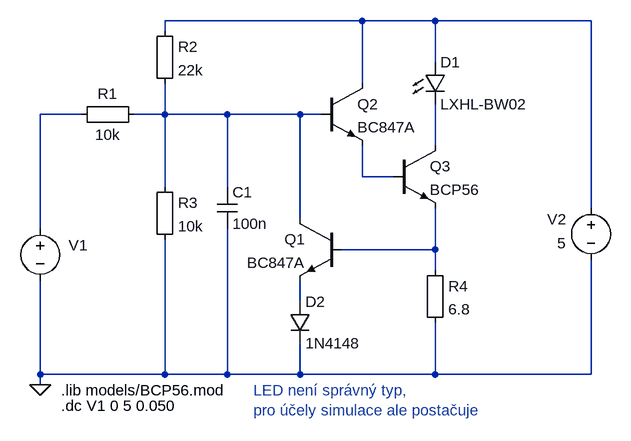
[diagram p0: schematic ambient-linear-prod.asc]
ambient-linear-prod.asc, the LTspice schematic file:
Version 4
SHEET 1 1960 680
WIRE 576 -240 272 -240
WIRE 688 -240 576 -240
WIRE 928 -240 688 -240
WIRE 272 -224 272 -240
WIRE 688 -176 688 -240
WIRE 576 -144 576 -240
WIRE 144 -96 80 -96
WIRE 272 -96 272 -144
WIRE 272 -96 224 -96
WIRE 368 -96 272 -96
WIRE 480 -96 368 -96
WIRE 512 -96 480 -96
WIRE 688 -48 688 -112
WIRE 576 0 576 -48
WIRE 624 0 576 0
WIRE 272 16 272 -96
WIRE 368 16 368 -96
WIRE 928 48 928 -240
WIRE 480 64 480 -96
WIRE 80 80 80 -96
WIRE 688 112 688 48
WIRE 688 112 544 112
WIRE 688 144 688 112
WIRE 480 192 480 160
WIRE 80 304 80 160
WIRE 272 304 272 96
WIRE 272 304 80 304
WIRE 368 304 368 80
WIRE 368 304 272 304
WIRE 480 304 480 256
WIRE 480 304 368 304
WIRE 688 304 688 224
WIRE 688 304 480 304
WIRE 928 304 928 128
WIRE 928 304 688 304
WIRE 80 320 80 304
FLAG 80 320 0
SYMBOL voltage 80 64 R0
WINDOW 3 43 64 Left 2
WINDOW 123 0 0 Left 0
WINDOW 39 0 0 Left 0
WINDOW 0 44 41 Left 2
SYMATTR Value ""
SYMATTR InstName V1
SYMBOL Misc\\EuropeanResistor 256 0 R0
SYMATTR InstName R3
SYMATTR Value 10k
SYMBOL Misc\\EuropeanResistor 672 128 R0
SYMATTR InstName R4
SYMATTR Value 6.8
SYMBOL voltage 928 32 R0
WINDOW 123 0 0 Left 0
WINDOW 39 0 0 Left 0
WINDOW 0 -67 33 Left 2
WINDOW 3 -52 70 Left 2
SYMATTR InstName V2
SYMATTR Value 5
SYMBOL npn 544 64 M0
SYMATTR InstName Q1
SYMATTR Value BC847A
SYMBOL npn 624 -48 R0
SYMATTR InstName Q3
SYMATTR Value BCP56
SYMBOL npn 512 -144 R0
SYMATTR InstName Q2
SYMATTR Value BC847A
SYMBOL Misc\\EuropeanResistor 240 -112 R90
WINDOW 0 0 56 VBottom 2
WINDOW 3 32 56 VTop 2
SYMATTR InstName R1
SYMATTR Value 10k
SYMBOL diode 464 192 R0
SYMATTR InstName D2
SYMATTR Value 1N4148
SYMBOL Misc\\EuropeanResistor 256 -240 R0
SYMATTR InstName R2
SYMATTR Value 22k
SYMBOL LED 672 -176 R0
SYMATTR InstName D1
SYMATTR Value LXHL-BW02
SYMATTR Description Diode
SYMATTR Type diode
SYMBOL cap 352 16 R0
SYMATTR InstName C1
SYMATTR Value 100n
TEXT 112 352 Left 2 !.dc V1 0 5 0.050
TEXT 112 328 Left 2 !.lib models/BCP56.mod
TEXT 408 328 Left 2 ;LED není správný typ,\npro účely simulace ale postačuje

The netlist it stands for:
* ambient-linear-prod.asc
V1 N002 0
R3 N003 0 10k
R4 N006 0 6.8
V2 N001 0 5
Q1 N003 N006 N007 0 BC847A
Q3 N004 N005 N006 0 BCP56
Q2 N001 N003 N005 0 BC847A
R1 N003 N002 10k
D2 N007 0 1N4148
R2 N001 N003 22k
D1 N001 N004 LXHL-BW02
C1 N003 0 100n
.model D D
.lib standard.dio
.model NPN NPN
.model PNP PNP
.lib standard.bjt
.dc V1 0 5 0.050
.lib models/BCP56.mod
* LED není správný typ,
* pro účely simulace ale postačuje
.backanno
.end